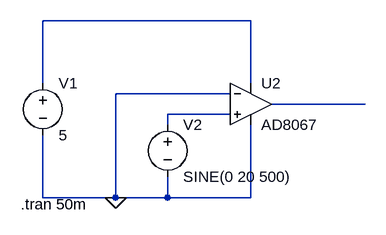
[diagram p0: schematic Draft2.asc]
Draft2.asc, the LTspice schematic file:
Version 4
SHEET 1 944 680
WIRE 464 64 144 64
WIRE 144 160 144 64
WIRE 464 160 464 64
WIRE 432 176 256 176
WIRE 640 192 496 192
WIRE 432 208 336 208
WIRE 336 224 336 208
WIRE 144 336 144 240
WIRE 256 336 256 176
WIRE 256 336 144 336
WIRE 336 336 336 304
WIRE 336 336 256 336
WIRE 464 336 464 224
WIRE 464 336 336 336
FLAG 256 336 0
SYMBOL voltage 144 144 R0
WINDOW 123 0 0 Left 0
WINDOW 39 0 0 Left 0
SYMATTR InstName V1
SYMATTR Value 5
SYMBOL voltage 336 208 R0
WINDOW 123 0 0 Left 0
WINDOW 39 0 0 Left 0
SYMATTR InstName V2
SYMATTR Value SINE(0 20 500)
SYMBOL OpAmps\\AD8067 464 128 R0
SYMATTR InstName U2
TEXT 110 346 Left 2 !.tran 50m

The netlist it stands for:
* Draft2.asc
V1 N001 0 5
V2 N003 0 SINE(0 20 500)
XU2 N003 0 N001 0 N002 AD8067  ; pins In+ In- V+ V- OUT
.tran 50m
.backanno
.end